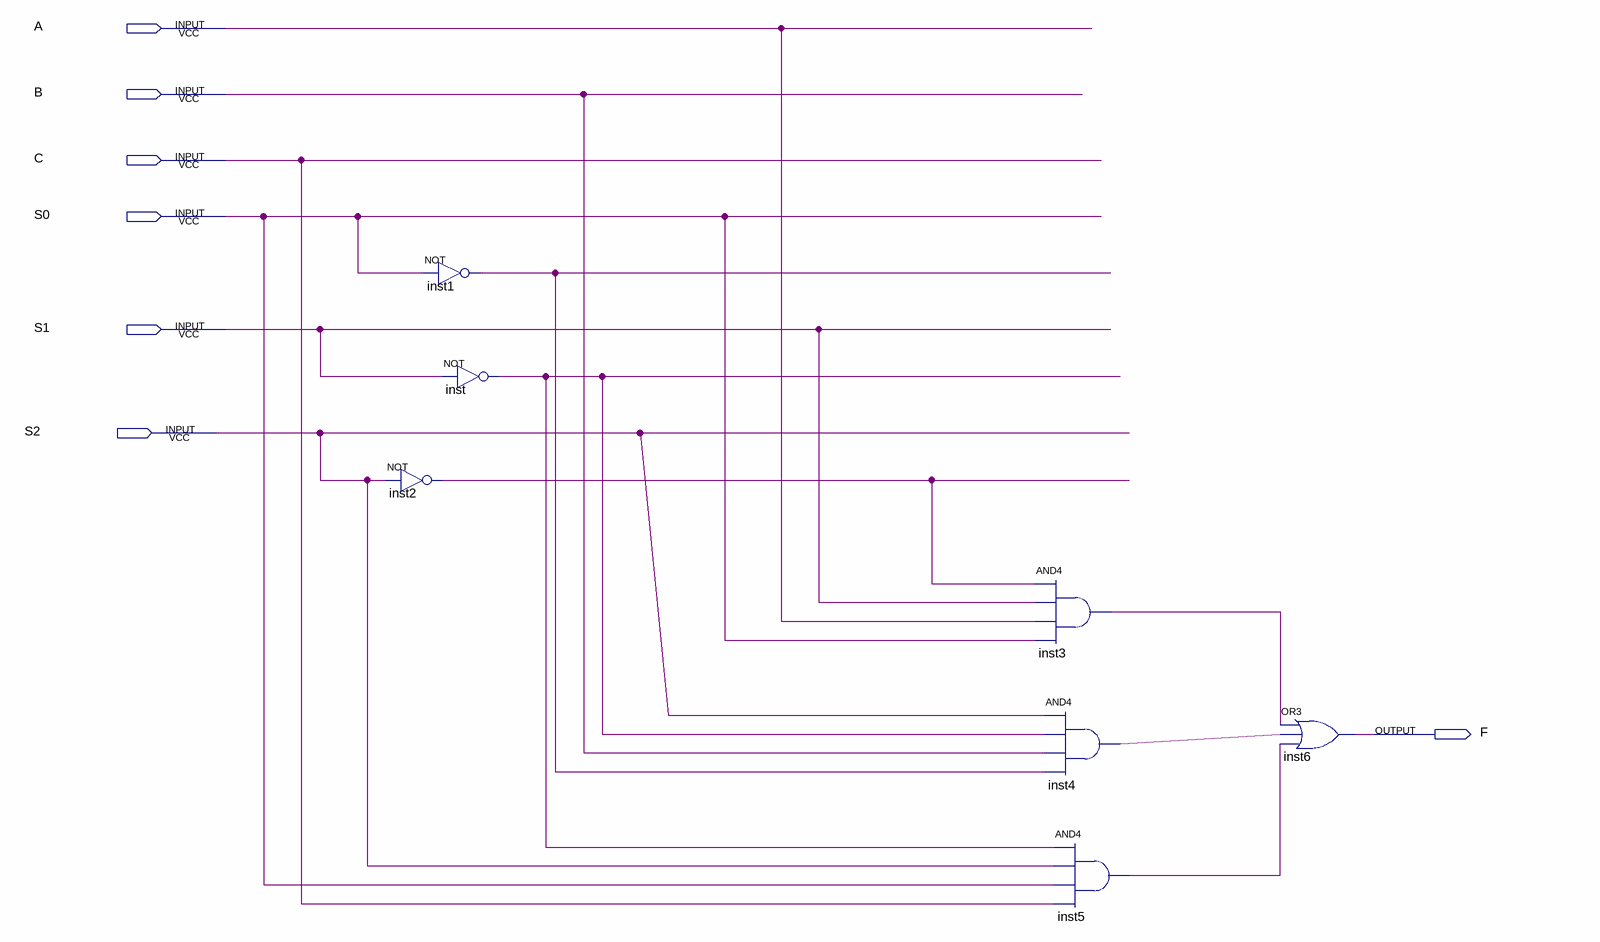
[diagram p0: schematic sheet]
// Quartus schematic MuxBool.bdf as structural Verilog: 7 symbols, 7 pins
module MuxBool (
  input  A,
  input  B,
  input  C,
  input  S0,
  input  S1,
  input  S2,
  output F
);

  wire inst1_out, inst2_out, inst3_out, inst4_out, inst5_out, inst_out;

  not inst1 (inst1_out, S0);
  not inst2 (inst2_out, S2);
  not inst (inst_out, S1);
  and inst3 (inst3_out, inst2_out, S1, A, S0);
  and inst4 (inst4_out, S2, inst_out, B, inst1_out);
  and inst5 (inst5_out, inst_out, S2, S0, C);
  or inst6 (F, inst3_out, inst4_out, inst5_out);
endmodule
